# Altium schematic sheet Sheet1.SchDoc
size A4
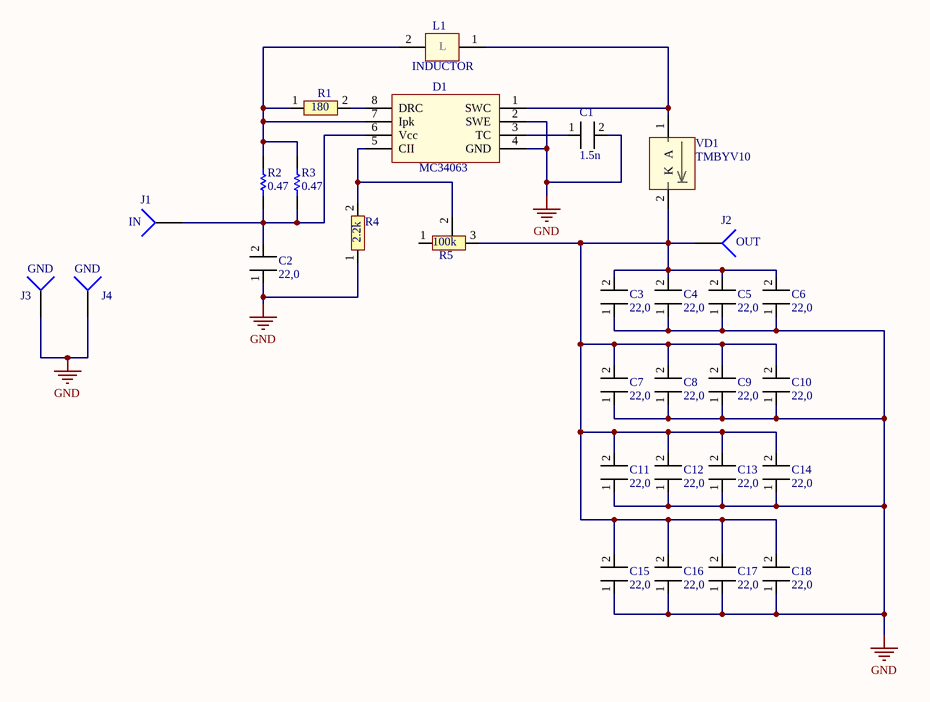
[diagram p0: Sheet1.SchDoc]

## Parts
C1  1.5n  [CAP_SMALL]
C2  22,0  [Cap_BIG]
C3  22,0  [MHDR1X2]
C4  22,0  [MHDR1X2]
C5  22,0  [MHDR1X2]
C6  22,0  [MHDR1X2]
C7  22,0  [MHDR1X2]
C8  22,0  [MHDR1X2]
C9  22,0  [MHDR1X2]
C10  22,0  [MHDR1X2]
C11  22,0  [MHDR1X2]
C12  22,0  [MHDR1X2]
C13  22,0  [MHDR1X2]
C14  22,0  [MHDR1X2]
C15  22,0  [MHDR1X2]
C16  22,0  [MHDR1X2]
C17  22,0  [MHDR1X2]
C18  22,0  [MHDR1X2]
D1  MC34063  [SOIC127P600X175-8N]
J1  IN  [PIN1]
J2  OUT  [PIN1]
J3  GND  [PIN1]
J4  GND  [PIN1]
L1  INDUCTOR  [1812]
R1  180  [RES]
R2  0.47  [AXIAL-0.3]
R3  0.47  [AXIAL-0.3]
R4  2.2k  [RES]
R5  100k  [PODSTR_RES_1]
VD1  TMBYV10  [TMBYV10-60]

## Nets
GND: C1.2 C2.1 C3.1 C4.1 C5.1 C6.1 C7.1 C8.1 C9.1 C10.1 C11.1 C12.1 C13.1 C14.1 C15.1 C16.1 C17.1 C18.1 D1.2(SWE) D1.4(GND) J3.1 J4.1 R4.1
NetC1_1: C1.1 D1.3(TC)
NetC2_2: C2.2 D1.6(Vcc) J1.1 R2.1 R3.1
NetC3_2: C3.2 C4.2 C5.2 C6.2 C7.2 C8.2 C9.2 C10.2 C11.2 C12.2 C13.2 C14.2 C15.2 C16.2 C17.2 C18.2 J2.1 R5.3 VD1.2(K)
NetD1_1: D1.1(SWC) L1.1 VD1.1(A)
NetD1_5: D1.5(CII) R4.2 R5.2
NetD1_7: D1.7(Ipk) L1.2 R1.1 R2.2 R3.2
NetD1_8: D1.8(DRC) R1.2

Not connected (* = marked no-connect by the designer): R5 1

## Notes on the sheet
- (in symbol INDUCTOR) L

## Library data of the parts
C1 = CAP_SMALL
C2-C18 = CAP_BIG
D1 = MC34063A/E
J1-J4 = Socket: LatestRevisionDate: 17-Jul-2002; LatestRevisionNote: Re-released for DXP Platform.; Publisher: Altium Limited
R1 R4 = RES
R2 R3 = Res1: Resistor; Published: 8-Jun-2000; LatestRevisionDate: 17-Jul-2002; LatestRevisionNote: Re-released for DXP Platform.; PackageReference: AXIAL-0.3; Publisher: Altium Limited; PackageDescription: Axial Device, Thru-Hole; 2 Leads; 0.3 in Pin Spacing; Value: 0.47
R5 = RES_PODSTR_1
VD1 = TMBYV10-60